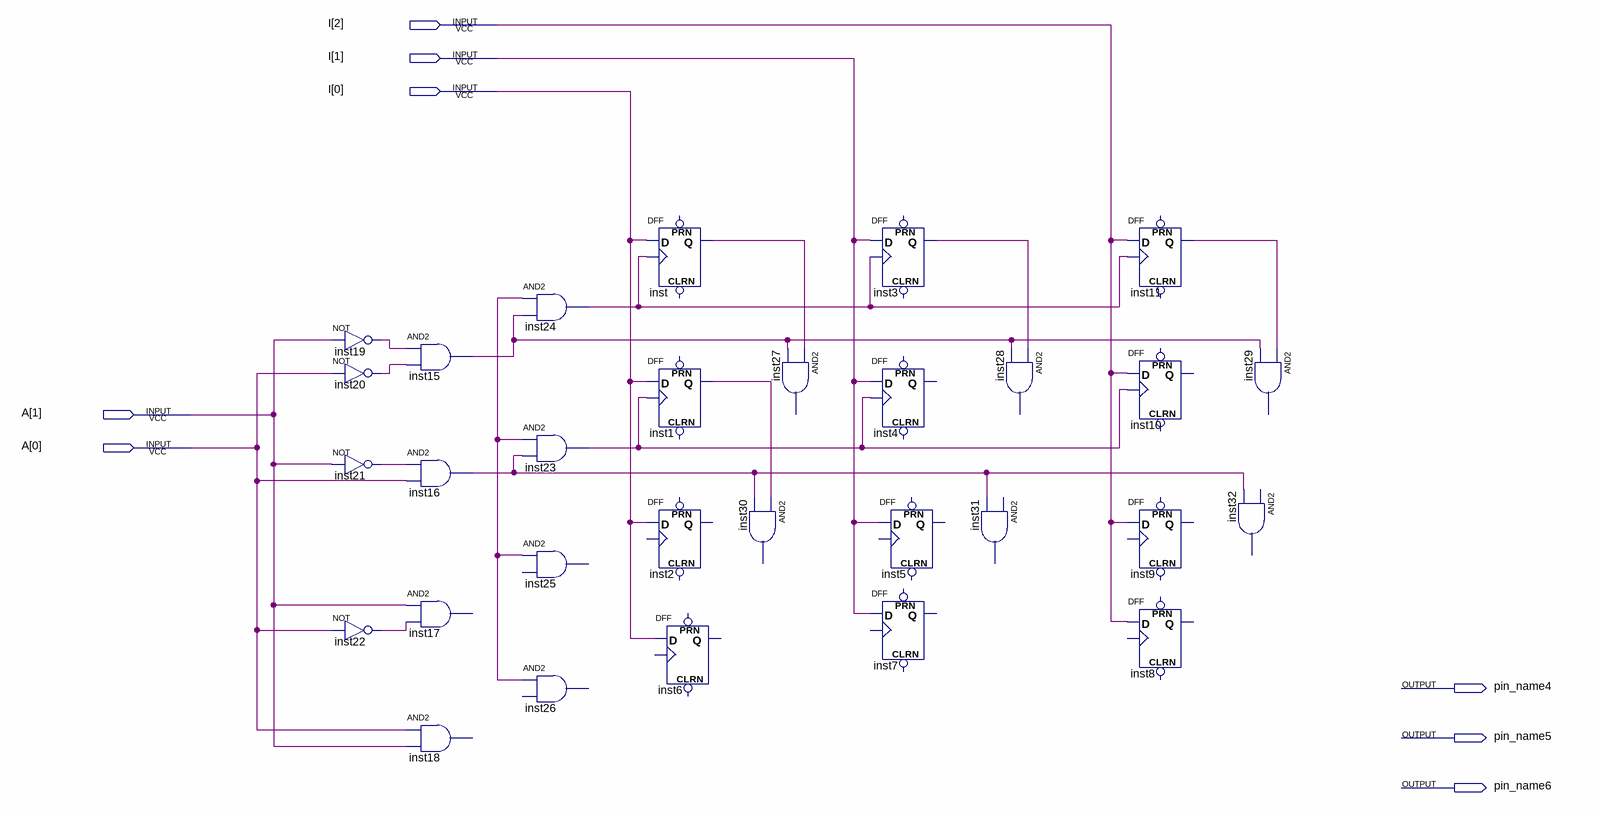
[diagram p0: schematic sheet]
// Quartus schematic MEM_4x3.bdf as structural Verilog: 30 symbols, 8 pins
module MEM_4x3 (
  input  [2:0] I,
  input  [1:0] A,
  output pin_name4,
  output pin_name5,
  output pin_name6
);

  wire inst1_q, inst3_q, inst11_q, inst15_out, inst16_out, inst19_out, inst20_out, inst21_out, inst22_out,
       inst23_out, inst24_out, inst_q, undriven;

  not inst19 (inst19_out, A[1]);
  not inst20 (inst20_out, A[0]);
  not inst21 (inst21_out, A[1]);
  not inst22 (inst22_out, A[0]);
  and inst15 (inst15_out, inst19_out, inst20_out);
  and inst16 (inst16_out, inst21_out, A[0]);
  // AND2 inst17 has open pins: IN1=A[1], IN2=inst22_out, OUT=open
  // AND2 inst18 has open pins: IN1=A[0], IN2=A[1], OUT=open
  and inst24 (inst24_out, undriven, inst15_out);
  and inst23 (inst23_out, undriven, inst16_out);
  // AND2 inst25 has open pins: IN1=undriven, IN2=open, OUT=open
  // AND2 inst26 has open pins: IN1=undriven, IN2=open, OUT=open
  DFF inst (.CLK(inst24_out), .D(I[0]), .Q(inst_q));  // open: CLRN, PRN
  DFF inst1 (.CLK(inst23_out), .D(I[0]), .Q(inst1_q));  // open: CLRN, PRN
  DFF inst2 (.D(I[0]));  // open: CLRN, CLK, PRN, Q
  DFF inst6 (.D(I[0]));  // open: CLRN, CLK, PRN, Q
  // AND2 inst27 has open pins: IN1=inst_q, IN2=inst15_out, OUT=open
  // AND2 inst30 has open pins: IN1=inst1_q, IN2=inst16_out, OUT=open
  DFF inst3 (.CLK(inst24_out), .D(I[1]), .Q(inst3_q));  // open: CLRN, PRN
  DFF inst4 (.CLK(inst23_out), .D(I[1]));  // open: CLRN, PRN, Q
  DFF inst5 (.D(I[1]));  // open: CLRN, CLK, PRN, Q
  DFF inst7 (.D(I[1]));  // open: CLRN, CLK, PRN, Q
  // AND2 inst31 has open pins: IN1=open, IN2=inst16_out, OUT=open
  // AND2 inst28 has open pins: IN1=inst3_q, IN2=inst15_out, OUT=open
  DFF inst11 (.CLK(inst24_out), .D(I[2]), .Q(inst11_q));  // open: CLRN, PRN
  DFF inst10 (.CLK(inst23_out), .D(I[2]));  // open: CLRN, PRN, Q
  DFF inst9 (.D(I[2]));  // open: CLRN, CLK, PRN, Q
  DFF inst8 (.D(I[2]));  // open: CLRN, CLK, PRN, Q
  // AND2 inst32 has open pins: IN1=open, IN2=inst16_out, OUT=open
  // AND2 inst29 has open pins: IN1=inst11_q, IN2=inst15_out, OUT=open
endmodule
